# Altium schematic sheet Power.SchDoc
size 209 x 297 mm; SheetNumber: 1; SheetTotal: 6; Разработчик: Волков; Проверяющий: Андрейчук; Технический_контроль: Ашуркевич; Нормативный_контроль: Василевская; Утвердил: Чвала; Номер_листа: 1; Количество_листов: 4; Организация: МРК; Номер_документа: ТЗСЦ.421457.001Э3; Название_документа: Устройство управления сервоприводами на основе микроконтроллера STM32
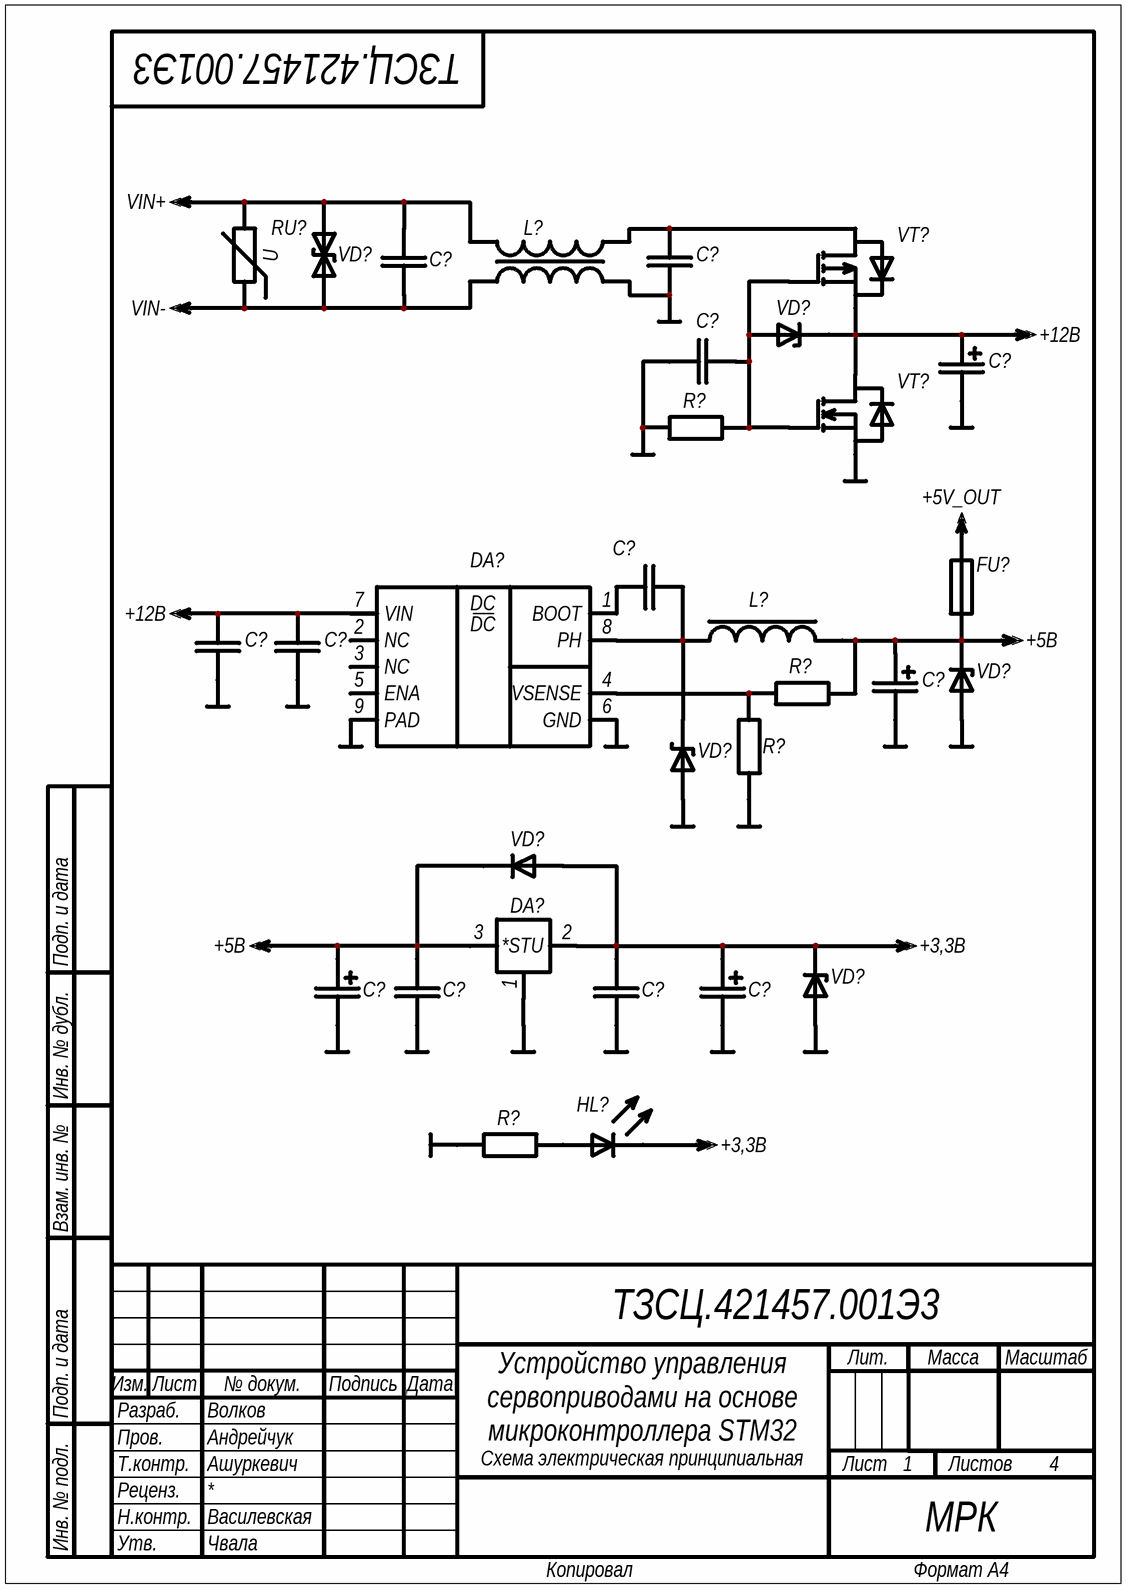
[diagram p0: Power.SchDoc]

## Parts
(Parts that share a designator on the sheet are numbered #1, #2 ... from top to bottom, then left to right.)
C?#1  Capacitor_Fixed  (value not drawn)
C?#2  Capacitor_Fixed  (value not drawn)
C?#3  Capacitor_Polarized  (value not drawn)
C?#4  Capacitor_Fixed  (value not drawn)
C?#5  Capacitor_Fixed  (value not drawn)
C?#6  Capacitor_Polarized  (value not drawn)
C?#7  Capacitor_Fixed  (value not drawn)
C?#8  Capacitor_Fixed  (value not drawn)
C?#9  Capacitor_Polarized  (value not drawn)
C?#10  Capacitor_Polarized  (value not drawn)
C?#11  Capacitor_Fixed  (value not drawn)
C?#12  Capacitor_Fixed  (value not drawn)
DA?#1  TPS5430DDAR  (value not drawn)
DA?#2  LM1117MP  (value not drawn)
FU?  Fuse  (value not drawn)
HL?  Diode_Light_Emitting  (value not drawn)
L?#1  Inductor_Cored_Double  (value not drawn)
L?#2  Inductor_Cored  (value not drawn)
R?#1  Resistor_Fixed  (value not drawn)
R?#2  Resistor_Fixed  (value not drawn)
R?#3  Resistor_Fixed  (value not drawn)
R?#4  Resistor_Fixed  (value not drawn)
RU?  Resistor_Varistor  (value not drawn)
VD?#1  5.0SMDJ36CA  (value not drawn)
VD?#2  Diode_Zener  (value not drawn)
VD?#3  Diode_Zener  (value not drawn)
VD?#4  Diode_Schottky  (value not drawn)
VD?#5  Diode_Junction  (value not drawn)
VD?#6  Diode_Zener  (value not drawn)
VT?#1  STD35P6LLF6  (value not drawn)
VT?#2  FDB7030BL  (value not drawn)

## Nets
+3,3В: C?#10.1(Anode) C?#12.2 DA?#2.2(VOUT) HL?.2(Cathode) VD?#5.1(Anode) VD?#6.2(Cathode)
+5V_OUT: FU?.2
+5В: C?#6.1(Anode) C?#9.1(Anode) C?#11.2 DA?#2.3(VIN) FU?.1 L?#2.2 R?#2.2 VD?#3.2(Cathode) VD?#5.2(Cathode)
+12В: C?#3.1(Anode) C?#7.2 C?#8.2 DA?#1.7(VIN) VD?#2.2(Cathode) VT?#1.2(Source) VT?#2.3(Drain)
GND: C?#2.1 C?#3.2(Cathode) C?#4.1 C?#6.2(Cathode) C?#7.1 C?#8.1 C?#9.2(Cathode) C?#10.2(Cathode) C?#11.1 C?#12.1 DA?#1.6(GND) DA?#1.9(PAD) DA?#2.1(GND) L?#1.3 R?#1.1 R?#3.1 R?#4.2 VD?#3.1(Anode) VD?#4.1(Anode) VD?#6.1(Anode) VT?#2.2(Source)
VIN+: C?#1.1 L?#1.1 RU?.2 VD?#1.2
VIN-: C?#1.2 L?#1.2 RU?.1 VD?#1.1
NetC?#2_2: C?#2.2 L?#1.4 VT?#1.3(Drain)
NetC?#4_2: C?#4.2 R?#1.2 VD?#2.1(Anode) VT?#1.1(Gate) VT?#2.1(Gate)
NetC?#5_1: C?#5.1 DA?#1.1(BOOT)
NetC?#5_2: C?#5.2 DA?#1.8(PH) L?#2.1 VD?#4.2(Cathode)
NetDA?#1_4: DA?#1.4(VSENSE) R?#2.1 R?#3.2
NetHL?_1: HL?.1(Anode) R?#4.1

Not connected (* = marked no-connect by the designer): DA?#1 2(NC) 3(NC) 5(ENA)

## Notes on the sheet
- Подп. и дата
- Инв. № дубл.
- Взам. инв. №
- Разраб.
- Изм.
- Лист
- № докум.
- Подпись
- Дата
- Лит.
- Масса
- Масштаб
- Пров.
- Т.контр.
- Схема электрическая принципиальная
- Листов
- Реценз.
- Н.контр.
- Утв.
- Инв. № подл.
- Копировал
- Формат А4
- (in symbol Microcircuit_Analog_DC_DC_Converter_TPS5430) DC
- (in symbol Microcircuit_Analog_Linear_Stabilizer_LM1117MP) *STU
- (in symbol Resistor_Varistor) U

## Library data of the parts
C?#1 C?#2 C?#4 C?#5 C?#7 C?#8 C?#11 C?#12 = Capacitor_Fixed: 2 pin
C?#3 C?#6 C?#9 C?#10 = Capacitor_Polarized: 2 pin
DA?#1 = Microcircuit_Analog_DC_DC_Converter_TPS5430: 8 pin + pad from 12V to 5V; ComponentLink1Description: chipdip; ComponentLink1URL: https://www.chipdip.ru/product/tps5430ddar; ComponentLink2Description: datasheet; ComponentLink2URL: https://static.chipdip.ru/lib/666/DOC012666766.pdf
DA?#2 = Microcircuit_Analog_Linear_Stabilizer_LM1117MP: 3 pin from 5V to 3,3V; ComponentLink1Description: chipdip; ComponentLink1URL: https://www.chipdip.ru/product/lm1117mp-3.3-nopb-sot223; ComponentLink2Description: datasheet; ComponentLink2URL: https://static.chipdip.ru/lib/028/DOC013028610.pdf
FU? = Fuse: 2 pin
HL? = Diode_Light_Emitting: 2 pin
L?#1 = Inductor_Cored_Double: 4 pin
L?#2 = Inductor_Cored: 2 pin
R?#1-R?#4 = Resistor_Fixed: 2 pin
RU? = Resistor_Varistor: 2 pin
VD?#1 = Diode_Suppressor_5.0SMDJ36CA: 2 pin; ComponentLink1Description: chipdip; ComponentLink1URL: https://www.chipdip.by/product0/8003261599; ComponentLink2Description: datasheet; ComponentLink2URL: https://static.chipdip.ru/lib/948/DOC005948039.pdf
VD?#2 VD?#3 VD?#6 = Diode_Zener: 2 pin
VD?#4 = Diode_Schottky: 2 pin
VD?#5 = Diode_Junction: 2 pin
VT?#1 = Transistor_Field_Effect_P_Induced_Channel_STD35P6LLF6: 3 pin; ComponentLink1Description: https://www.chipdip.by/product/std35p6llf6-umw; ComponentLink1URL: https://static.chipdip.ru/lib/207/DOC035207126.pdf; ComponentLink2Description: datasheet; ComponentLink2URL: https://static.chipdip.ru/lib/207/DOC035207126.pdf
VT?#2 = Transistor_Field_Effect_N_Induced_Channel_FDB7030BL: 3 pin; ComponentLink1Description: chipdip; ComponentLink1URL: https://www.chipdip.by/product/fdp7030bl-fairchild; ComponentLink2Description: datasheet; ComponentLink2URL: https://static.chipdip.ru/lib/304/DOC004304509.pdf